# EAGLE design Zavlazovac-v20 (EAGLE 4.11)
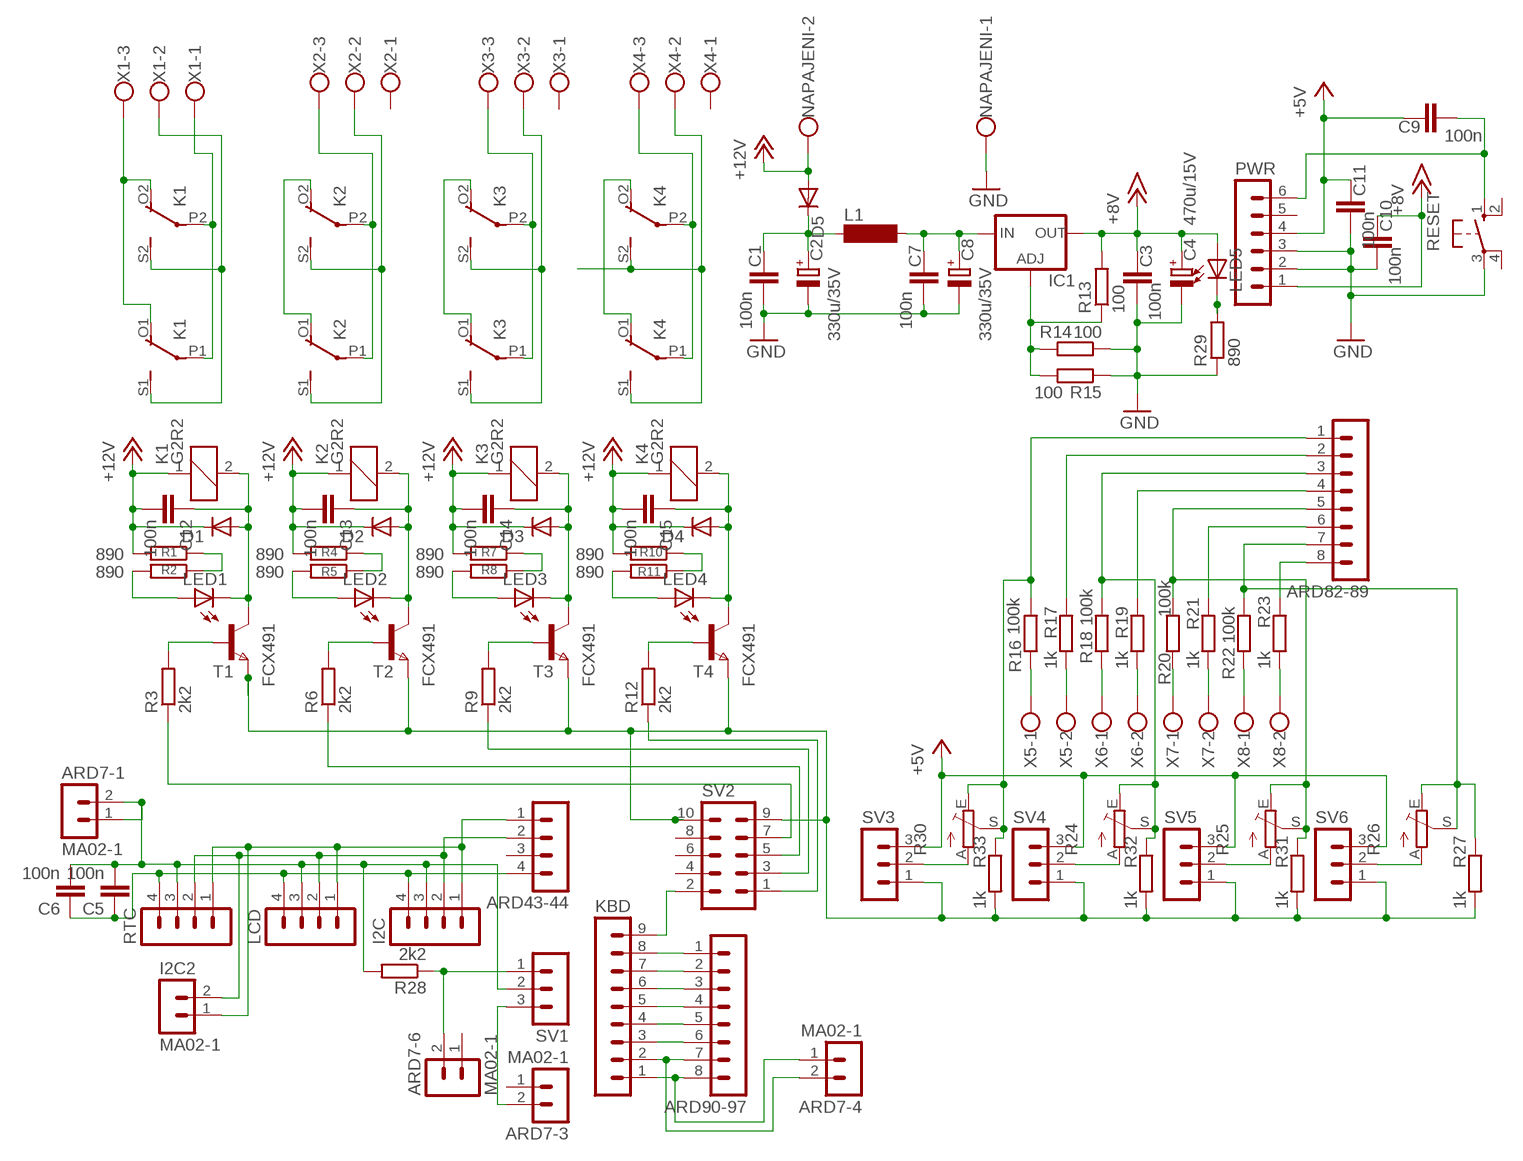
[diagram p0: schematic, sheet 1]

## Parts
ARD7-1  MA02-1  [MA02-01]
ARD7-3  MA02-1  [MA02-01]
ARD7-4  MA02-1  [MA02-01]
ARD7-6  MA02-1  [MA02-01]
ARD43-44  MA04-1  [MA04-1]
ARD82-89  MA08-1  [MA08-1]
ARD90-97  MA08-1  [MA08-1]
C1  100n  C-EUC1206  [C1206]
C2  330u/35V  CPOL-EUE5-8.5  [E5-8,5]
C3  100n  C-EUC1206  [C1206]
C4  470u/15V  CPOL-EUE5-8.5  [E5-8,5]
C5  100n  C-EUC1206  [C1206]
C6  100n  C-EUC1206  [C1206]
C7  100n  C-EUC1206  [C1206]
C8  330u/35V  CPOL-EUE5-8.5  [E5-8,5]
C9  100n  C-EUC1206  [C1206]
C10  100n  C-EUC1206  [C1206]
C11  100n  C-EUC1206  [C1206]
C12  100n  C-EUC1206  [C1206]
C13  100n  C-EUC1206  [C1206]
C14  100n  C-EUC1206  [C1206]
C15  100n  C-EUC1206  [C1206]
D1  DIODE-SMB  [SMB]
D2  DIODE-SMB  [SMB]
D3  DIODE-SMB  [SMB]
D4  DIODE-SMB  [SMB]
D5  DIODE-SMB  [SMB]
I2C  MA04-1  [MA04-1]
I2C2  MA02-1  [MA02-01]
IC1  LM317TL  [317TL]
K1  G2R2  [G2R2]
K2  G2R2  [G2R2]
K3  G2R2  [G2R2]
K4  G2R2  [G2R2]
KBD  MA09-1  [MA09-1]
L1  MS85  [MS85]
LCD  MA04-1  [MA04-1]
LED1  LED5MM  [LED5MM]
LED2  LED5MM  [LED5MM]
LED3  LED5MM  [LED5MM]
LED4  LED5MM  [LED5MM]
LED5  LED5MM  [LED5MM]
NAPAJENI  W237-102  [W237-102]
PWR  MA06-1  [MA06-1]
R1  890  R-EU_M1206  [M1206]
R2  890  R-EU_M1206  [M1206]
R3  2k2  R-EU_M1206  [M1206]
R4  890  R-EU_M1206  [M1206]
R5  890  R-EU_M1206  [M1206]
R6  2k2  R-EU_M1206  [M1206]
R7  890  R-EU_M1206  [M1206]
R8  890  R-EU_M1206  [M1206]
R9  2k2  R-EU_M1206  [M1206]
R10  890  R-EU_M1206  [M1206]
R11  890  R-EU_M1206  [M1206]
R12  2k2  R-EU_M1206  [M1206]
R13  100  R-EU_M1206  [M1206]
R14  100  R-EU_M1206  [M1206]
R15  100  R-EU_M1206  [M1206]
R16  100k  R-EU_M1206  [M1206]
R17  1k  R-EU_M1206  [M1206]
R18  100k  R-EU_M1206  [M1206]
R19  1k  R-EU_M1206  [M1206]
R20  100k  R-EU_M1206  [M1206]
R21  1k  R-EU_M1206  [M1206]
R22  100k  R-EU_M1206  [M1206]
R23  1k  R-EU_M1206  [M1206]
R24  TRIM_EU-S75H  [S75H]
R25  TRIM_EU-S75H  [S75H]
R26  TRIM_EU-S75H  [S75H]
R27  1k  R-EU_M1206  [M1206]
R28  2k2  R-EU_M1206  [M1206]
R29  890  R-EU_M1206  [M1206]
R30  TRIM_EU-S75H  [S75H]
R31  1k  R-EU_M1206  [M1206]
R32  1k  R-EU_M1206  [M1206]
R33  1k  R-EU_M1206  [M1206]
RESET  10-XX  [B3F-10XX]
RTC  MA04-1  [MA04-1]
SV1  MA03-1  [MA03-1]
SV2  MA05-2  [MA05-2]
SV3  MA03-1  [MA03-1]
SV4  MA03-1  [MA03-1]
SV5  MA03-1  [MA03-1]
SV6  MA03-1  [MA03-1]
T1  FCX491  NPNSOT89  [SOT89]
T2  FCX491  NPNSOT89  [SOT89]
T3  FCX491  NPNSOT89  [SOT89]
T4  FCX491  NPNSOT89  [SOT89]
X1  W237-103  [W237-103]
X2  W237-103  [W237-103]
X3  W237-103  [W237-103]
X4  W237-103  [W237-103]
X5  W237-102  [W237-102]
X6  W237-102  [W237-102]
X7  W237-102  [W237-102]
X8  W237-102  [W237-102]

## Nets
+5V: C9.1 C11.1 PWR.4 SV3.3 SV4.3 SV5.3 SV6.3
+8V: C3.1 C4.+ C10.1 IC1.2(OUT) LED5.A PWR.1 R13.2
+12V: C12.2 C13.2 C14.2 C15.2 D1.C D2.C D3.C D4.C D5.A K1.1 K2.1 K3.1 K4.1 NAPAJENI.2 R1.2 R4.2 R7.2 R10.2
GND: C1.2 C2.- C3.2 C4.- C7.2 C8.- C10.2 C11.2 NAPAJENI.1 PWR.2 PWR.3 R14.1 R15.1 R29.1 RESET.3(P)
N$1: R1.1 R2.1
N$2: LED1.A R2.2
N$3: C12.1 D1.A K1.2 LED1.K(C) T1.2(C)
N$4: R3.2 T1.1(B)
N$5: R12.1 SV2.1
N$6: K4.P1(2:P) K4.P2(3:P) X4.3
N$7: K1.S1(2:S) K1.S2(3:S) X1.2
N$8: C13.1 D2.A K2.2 LED2.K(C) T2.2(C)
N$9: R6.2 T2.1(B)
N$10: C9.2 PWR.6 RESET.1(S)
N$11: LED5.K(C) R29.2
N$12: K2.S1(2:S) K2.S2(3:S) X2.2
N$13: R4.1 R5.1
N$14: LED2.A R5.2
N$15: C14.1 D3.A K3.2 LED3.K(C) T3.2(C)
N$16: R9.2 T3.1(B)
N$18: ARD7-1.1 ARD7-1.2 C5.2 C6.2 I2C.3 LCD.3 R28.2 RTC.3 SV1.2
N$19: K3.S1(2:S) K3.S2(3:S) X3.2
N$20: R7.1 R8.1
N$21: LED3.A R8.2
N$22: C15.1 D4.A K4.2 LED4.K(C) T4.2(C)
N$23: R12.2 T4.1(B)
N$24: K1.P1(2:P) K1.P2(3:P) X1.1
N$25: R30.A SV3.2
N$26: IC1.1(ADJ) R13.1 R14.2 R15.2
N$27: R27.2 R31.2 R32.2 R33.2 SV2.9 SV2.10 SV3.1 SV4.1 SV5.1 SV6.1 T1.3(E) T2.3(E) T3.3(E) T4.3(E)
N$28: K4.S1(2:S) K4.S2(3:S) X4.2
N$29: R10.1 R11.1
N$30: LED4.A R11.2
N$31: R24.A SV4.2
N$32: R25.A SV5.2
N$33: R26.A SV6.2
N$34: ARD82-89.1 R16.1 R30.E R30.S R33.1
N$35: ARD82-89.2 R17.1
N$36: ARD82-89.3 R18.1 R24.E R24.S R32.1
N$37: ARD82-89.4 R19.1
N$38: ARD82-89.5 R20.1 R25.E R25.S R31.1
N$39: ARD82-89.6 R21.1
N$40: ARD43-44.4 C5.1 C6.1 I2C.4 LCD.4 RTC.4
N$41: ARD82-89.8 R23.1
N$42: R16.2 X5.1
N$43: R17.2 X5.2
N$44: R18.2 X6.1
N$45: R19.2 X6.2
N$46: R20.2 X7.1
N$47: R21.2 X7.2
N$48: R22.2 X8.1
N$49: R23.2 X8.2
N$50: ARD7-4.1 ARD90-97.8 KBD.1
N$51: K2.P1(2:P) K2.P2(3:P) X2.3
N$52: K3.P1(2:P) K3.P2(3:P) X3.3
N$53: ARD7-6.2 R28.1 SV1.1
N$54: ARD82-89.7 R22.1 R26.E R26.S R27.1
N$55: ARD7-4.2 ARD90-97.7 KBD.2
N$56: ARD90-97.6 KBD.3
N$57: ARD90-97.5 KBD.4
N$58: ARD90-97.4 KBD.5
N$59: ARD90-97.3 KBD.6
N$60: ARD90-97.2 KBD.7
N$61: ARD90-97.1 KBD.8
N$62: K1.O1(2:O) K1.O2(3:O) X1.3
N$63: R9.1 SV2.3
N$64: R6.1 SV2.5
N$65: R3.1 SV2.7
N$66: KBD.9 SV2.2
N$67: C1.1 C2.+ D5.C L1.1
N$68: C7.1 C8.+ IC1.3(IN) L1.2
N$69: K2.O1(2:O) K2.O2(3:O)
N$70: K3.O1(2:O) K3.O2(3:O)
N$71: K4.O1(2:O) K4.O2(3:O)
N$72: ARD7-3.2 SV1.3
SCL: ARD43-44.1 I2C2.1 I2C.1 LCD.1 RTC.1
SDA: ARD43-44.2 I2C2.2 I2C.2 LCD.2 RTC.2
Unconnected: ARD7-3.1 ARD7-6.1 ARD43-44.3 PWR.5 RESET.2(S1) RESET.4(P1) SV2.4 SV2.6 SV2.8 X2.1 X3.1 X4.1

## Library data of the parts
ARD7-1 ARD7-3 ARD7-4 ARD7-6 I2C2 = con-lstb:MA02-1
ARD43-44 I2C LCD RTC = con-lstb:MA04-1: PIN HEADER
ARD82-89 ARD90-97 = con-lstb:MA08-1: PIN HEADER
C1 C3 C5-C7 C9-C15 = rcl:C-EU: CAPACITOR, European symbol
C2 C4 C8 = rcl:CPOL-EU: POLARIZED CAPACITOR, European symbol
D1-D5 = diode:DIODE-: DIODE
IC1 = v-reg:LM317TL: VOLTAGE REGULATOR
K1-K4 = relay:G2R2: RELAY 2 x switch, Omron
KBD = con-lstb:MA09-1: PIN HEADER
L1 = inductor-neosid:MS85: INDUCTOR SMD power inductor
LED1-LED5 = led:LED: LED OSRAM: - CHIPLED LG R971, LG N971, LY N971, LG Q971, LY Q971, LO R971, LY R971 LH N974, LH R974 LS Q976, LO Q976, LY Q976 LO Q996 - Hyper CHIPLED LW Q18S LB Q993, LB Q99A, LB R99A - SideLED LS A670, LO A670, LY A670, LG A670, LP A670 LB A673, LV A673, LT A673, LW A673 LH A674 LY A675 LS A676, LA A676, LO A676, LY A676, LW A676 LS A679, LY A679, LG A679 - Hyper Micro SIDELED® LS Y876, LA Y876, LO Y876, LY Y876 LT Y87S - SmartLED LW L88C, LW L88S LB L89C, LB L89S, LG L890 LS L89K, LO L89K, LY L89K LS L896, LA L896, LO L896, LY L896 - TOPLED LS T670, LO T670, LY T670, LG T670, LP T670 LSG T670, LSP T670, LSY T670, LOP T670, LYG T670 LG T671, LOG T671, LSG T671 LB T673, LV T673, LT T673, LW T673 LH T674 LS T676, LA T676, LO T676, LY T676, LB T676, LH T676, LSB T676, LW T676 LB T67C, LV T67C, LT T67C, LS T67K, LO T67K, LY T67K, LW E67C LS E67B, LA E67B, LO E67B, LY E67B, LB E67C, LV E67C, LT E67C LW T67C LS T679, LY T679, LG T679 LS T770, LO T770, LY T770, LG T770, LP T770 LB T773, LV T773, LT T773, LW T773 LH T774 LS E675, LA E675, LY E675, LS T675 LS T776, LA T776, LO T776, LY T776, LB T776 LHGB T686 LT T68C, LB T68C - Hyper Mini TOPLED® LB M676 - Mini TOPLED Santana® LG M470 LS M47K, LO M47K, LY M47K Source: http://www.osram.convergy.de/
NAPAJENI X5-X8 = con-wago-500:W237-102: WAGO SCREW CLAMP
PWR = con-lstb:MA06-1: PIN HEADER
R1-R23 R27-R29 R31-R33 = rcl:R-EU_: RESISTOR, European symbol
R24-R26 R30 = pot:TRIM_EU-: POTENTIOMETER
RESET = switch-omron:10-XX: OMRON SWITCH
SV1 SV3-SV6 = con-lstb:MA03-1: PIN HEADER
SV2 = con-lstb:MA05-2: PIN HEADER
T1-T4 = zetex:NPNSOT89: NPN TRANSISTOR
X1-X4 = con-wago-500:W237-103: WAGO SCREW CLAMP

## Board
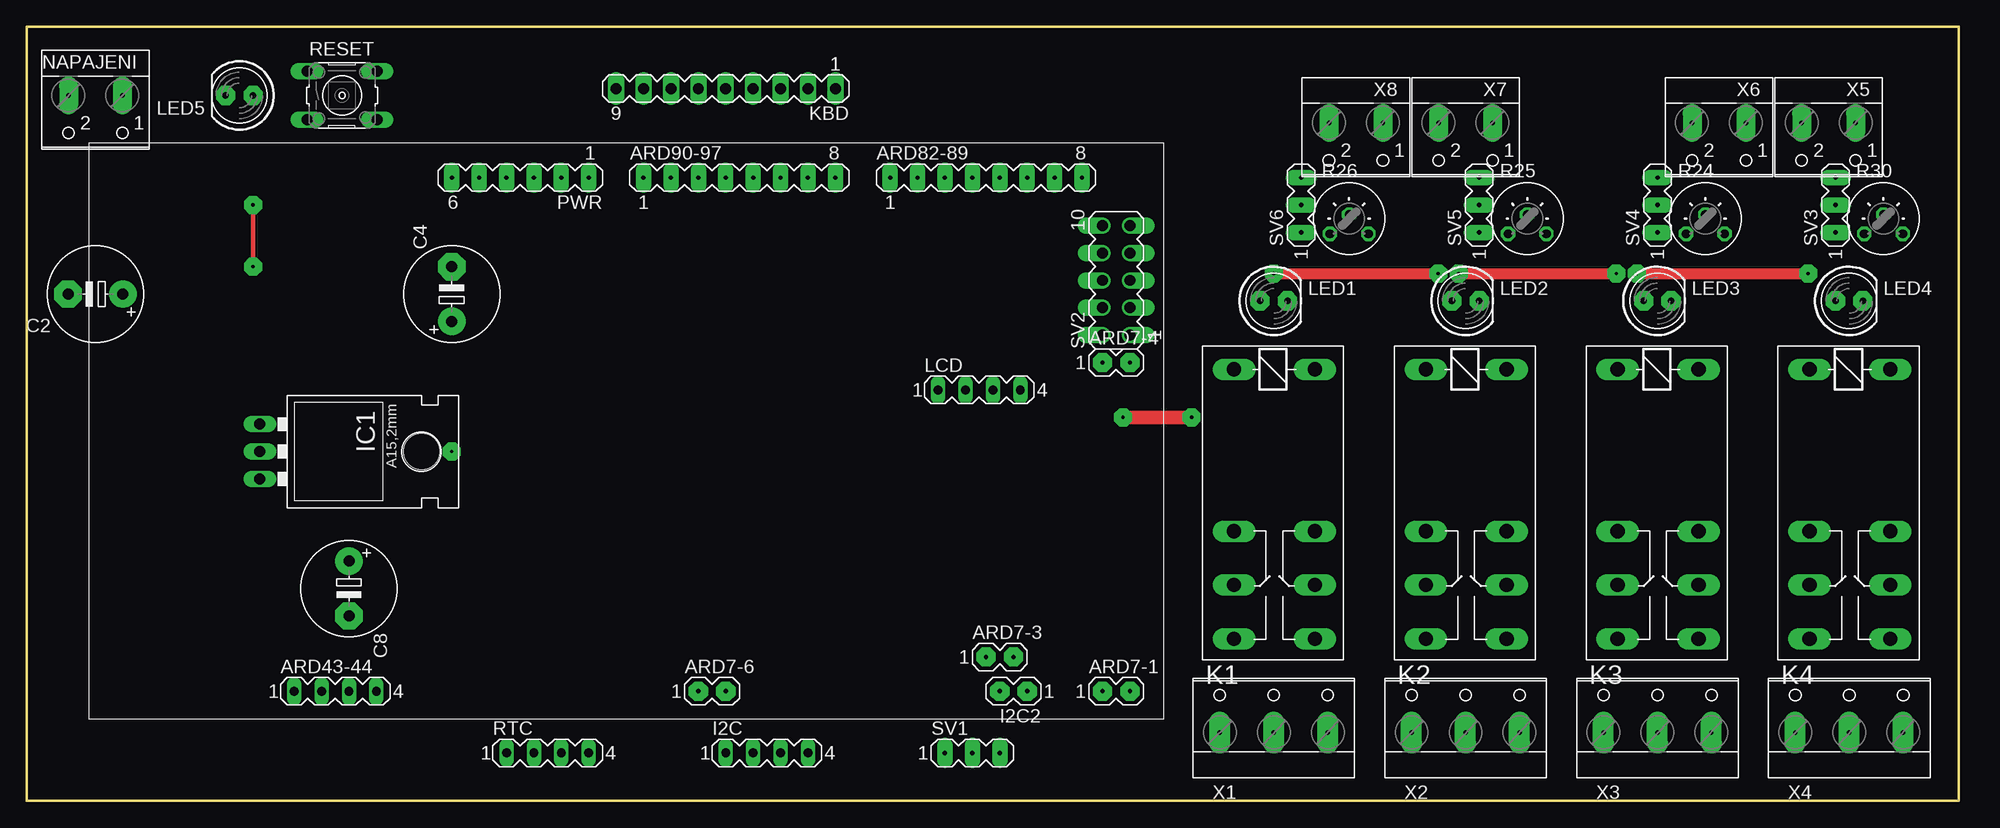
[diagram p1: board, top side]
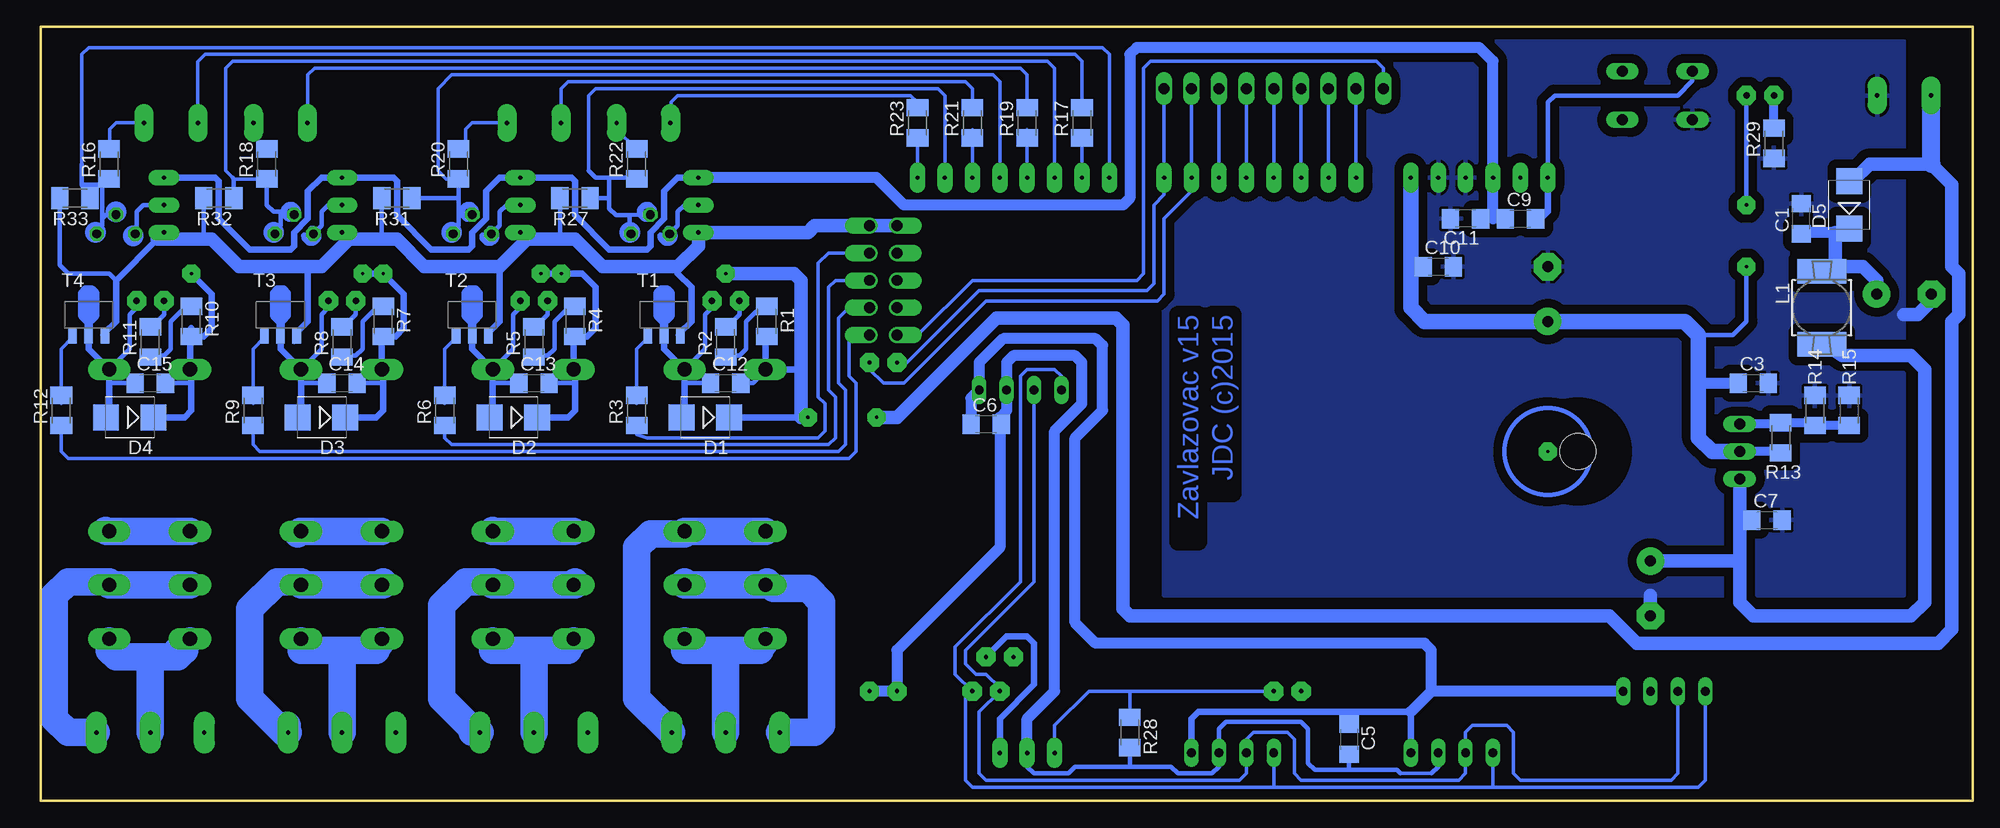
[diagram p2: board, bottom side, seen from below]

Size 179.07 x 71.75 mm. Coordinates in mm from the lower left corner, seen from the top.
Outline: 0,0 179.07,0 179.07,71.75 0,71.75 0,0
Copper layers (1*16): Top 0.035mm / dielectric 1.5mm / Bottom 0.035mm
Design rules "default": minimum track width 10mil, minimum drill 24mil, track to track 8mil, track to pad 8mil, pad to pad 8mil, via to via 8mil, smd to smd 8mil, copper to edge 40mil, drill to drill 8mil, minimum pad ring 10mil, minimum via ring 8mil, stop-mask expansion 4mil, vias tented up to drill 0mil, thermal gap 10mil

### Footprints (pad centres in the part's own frame; a part is rotated, then mirrored left to right if it is on the bottom)
MA02-01 = drill 0.406 pad 1.778 octagon: 1 0,0; 2 2.54,0
MA04-1 = drill 0.813 pad 1.27 long: 1 -3.81,0; 2 -1.27,0; 3 1.27,0; 4 3.81,0
MA08-1 = drill 0.406 pad 1.422 long: 1 -8.89,0; 2 -6.35,0; 3 -3.81,0; 4 -1.27,0; 5 1.27,0; 6 3.81,0; 7 6.35,0; 8 8.89,0
C1206 = smd 1.6 x 1.8: 1 -1.4,0; 2 1.4,0
E5-8,5 = drill 1.016 pad 2.54 round: + -2.54,0 | drill 1.016 pad 2.54 octagon: - 2.54,0
SMB = smd 2.4 x 2.4: A 2.2,0; C -2.2,0
317TL = drill 1.016 long: 1 -2.54,-3.81; 2 0,-3.81; 3 2.54,-3.81 | hole 3.302: 0,11.176
G2R2 = drill 1.321 long: 1 -2.54,-3.683; 2 -2.54,3.81; O1 12.471,3.81; O2 12.471,-3.683; P1 17.45,3.81; P2 17.45,-3.683; S1 22.454,3.81; S2 22.454,-3.683
MA09-1 = drill 1.016 long: 1 -10.16,0; 2 -7.62,0; 3 -5.08,0; 4 -2.54,0; 5 0,0; 6 2.54,0; 7 5.08,0; 8 7.62,0; 9 10.16,0
MS85 = smd 4.5 x 2.25: 1 0,-3.383; 2 0,3.383
LED5MM = drill 0.61 pad 1.778 octagon: A -1.27,0; K 1.27,0
W237-102 = drill 0.406 pad 1.778 long: 1 -2.5,-1.27; 2 2.5,-1.27
MA06-1 = drill 0.406 pad 1.422 long: 1 -6.35,0; 2 -3.81,0; 3 -1.27,0; 4 1.27,0; 5 3.81,0; 6 6.35,0
M1206 = smd 1.6 x 2: 1 -1.4,0; 2 1.4,0
S75H = drill 0.813 octagon: A -1.778,-1.397; E 1.778,-1.397; S 0,0.381
B3F-10XX = drill 1.016 long: 1 -3.251,2.261; 2 3.251,2.261; 3 -3.251,-2.261; 4 3.251,-2.261
MA03-1 = drill 0.406 pad 1.422 long: 1 -2.54,0; 2 0,0; 3 2.54,0
MA05-2 = drill 1.016 offset: 1 -5.08,-1.27; 2 -5.08,1.27; 3 -2.54,-1.27; 4 -2.54,1.27; 5 0,-1.27; 6 0,1.27; 7 2.54,-1.27; 8 2.54,1.27; 9 5.08,-1.27; 10 5.08,1.27
SOT89 = smd 0.8 x 1.4: 1 -1.499,-1.981; 2 0,-1.981; 3 1.499,-1.981
W237-103 = drill 0.406 pad 1.93 long: 1 -5,-1.29; 2 0,-1.29; 3 5,-1.29

### Placement (x,y rotation side)
ARD7-1  99.69,10.16 0 top
ARD7-3  88.9,13.34 0 top
ARD7-4  99.69,40.64 0 top
ARD7-6  62.23,10.16 0 top
ARD43-44  28.57,10.16 0 top
ARD82-89  88.9,57.78 0 top
ARD90-97  66.04,57.78 0 top
C1  15.88,53.98 90 bottom
C2  6.35,46.99 180 top
C3  20.32,38.73 0 bottom
C4  39.37,46.99 90 top
C5  57.78,5.71 270 bottom
C6  91.44,34.92 0 bottom
C7  19.05,26.04 0 bottom
C8  29.84,19.68 270 top
C9  41.91,53.98 0 bottom
C10  49.53,49.53 0 bottom
C11  46.99,53.98 180 bottom
C12  115.57,38.73 0 bottom
C13  133.35,38.73 0 bottom
C14  151.13,38.73 0 bottom
C15  168.91,38.73 0 bottom
D1  117.47,35.56 180 bottom
D2  135.25,35.56 180 bottom
D3  153.03,35.56 180 bottom
D4  170.81,35.56 180 bottom
D5  11.43,55.24 90 bottom
I2C  68.58,4.45 0 top
I2C2  92.71,10.16 180 top
IC1  25.4,32.38 270 top
K1  115.57,37.47 270 top
K2  133.35,37.47 270 top
K3  151.13,37.47 270 top
K4  168.91,37.47 270 top
KBD  64.77,66.04 180 top
L1  13.97,45.72 180 bottom
LCD  88.27,38.1 0 top
LED1  115.57,46.35 0 top
LED2  133.35,46.35 0 top
LED3  151.13,46.35 0 top
LED4  168.91,46.35 0 top
LED5  19.68,65.41 180 top
NAPAJENI  6.35,64.14 180 top
PWR  45.72,57.78 180 top
R1  111.76,44.45 270 bottom
R2  115.57,42.55 90 bottom
R3  123.83,36.2 90 bottom
R4  129.54,44.45 270 bottom
R5  133.35,42.55 90 bottom
R6  141.6,36.2 90 bottom
R7  147.32,44.45 270 bottom
R8  151.13,42.55 90 bottom
R9  159.38,36.2 90 bottom
R10  165.1,44.45 270 bottom
R11  168.91,42.55 90 bottom
R12  177.16,36.2 90 bottom
R13  17.78,33.66 270 bottom
R14  14.61,36.2 270 bottom
R15  11.43,36.2 270 bottom
R16  172.72,59.05 90 bottom
R17  82.55,62.87 90 bottom
R18  158.12,59.05 90 bottom
R19  87.63,62.87 90 bottom
R20  140.34,59.05 90 bottom
R21  92.71,62.87 90 bottom
R22  123.83,59.05 90 bottom
R23  97.79,62.87 90 bottom
R24  155.57,53.98 0 top
R25  139.06,53.98 0 top
R26  122.56,53.98 0 top
R27  129.54,55.88 180 bottom
R28  78.11,6.35 270 bottom
R29  18.41,60.96 90 bottom
R30  172.09,53.98 0 top
R31  146.05,55.88 180 bottom
R32  162.56,55.88 180 bottom
R33  175.9,55.88 180 bottom
RESET  29.21,65.41 0 top
RTC  48.26,4.45 0 top
SV1  87.63,4.45 0 top
SV2  100.97,48.26 90 top
SV3  167.64,55.24 90 top
SV4  151.13,55.24 90 top
SV5  134.62,55.24 90 top
SV6  118.11,55.24 90 top
T1  121.28,45.09 0 bottom
T2  139.06,45.09 0 bottom
T3  156.84,45.09 0 bottom
T4  174.62,45.09 0 bottom
X1  115.57,7.62 0 top
X2  133.35,7.62 0 top
X3  151.13,7.62 0 top
X4  168.91,7.62 0 top
X5  167,61.59 180 top
X6  156.84,61.59 180 top
X7  133.35,61.59 180 top
X8  123.19,61.59 180 top

### Tracks (layer width: path | path; a pad name or v marks a point on that pad's centre or on a via)
+5V
  Bottom 0.61: SV3.3 162.88,57.78 162.56,57.47 162.56,53.98 159.7,51.12 155.89,51.12 155.57,51.44 155.57,52.7 154.31,53.98 154.31,56.52 153.03,57.78 SV4.3 146.37,57.78 146.05,57.47 146.05,54.29 142.88,51.12 139.38,51.12 139.06,51.44 139.06,52.7 137.79,53.98 137.79,56.52 136.53,57.78 SV5.3 129.86,57.78 129.54,57.47 129.54,54.29 126.36,51.12 122.87,51.12 122.56,51.44 122.56,52.7 121.28,53.98 121.28,56.52 120.02,57.78 SV6.3 | 44.45,53.98 C11.1 C9.1 43.18,53.98
  Bottom 1.016: SV6.3 101.6,57.78 99.06,55.24 78.74,55.24 78.11,55.88 78.11,69.22 77.47,69.85 45.72,69.85 44.45,68.58 PWR.4 44.45,53.98
+8V  (via drill 0.3 pad 1.68)
  Top 0.406: v20.95,49.53 v20.95,55.24
  Bottom 0.406: v20.95,55.24 LED5.A | v20.95,49.53 20.95,44.45 22.23,43.18 25.4,43.18
  Bottom 0.813: R13.2 17.78,32.38 IC1.2
  Bottom 1.016: 25.4,38.73 C3.1 | 52.07,49.53 C10.1
  Bottom 1.422: IC1.2 24.13,32.38 25.4,33.66 25.4,38.73 25.4,43.18 26.67,44.45 C4.+ 50.8,44.45 52.07,45.72 52.07,49.53 PWR.1
+12V  (via drill 0.3 pad 1.68)
  Top 1.016: v149.22,48.9 v165.1,48.9 | v132.72,48.9 v147.32,48.9 | v115.57,48.9 v130.81,48.9
  Top 1.27: v101.6,35.56 v107.95,35.56
  Bottom 0.406: 111.76,43.18 111.76,42.55 | C12.2 113.03,38.73 111.76,40.01 | 129.54,38.73 C13.2 | 147.32,38.73 C14.2 | 165.1,38.73 C15.2
  Bottom 0.61: v165.1,48.9 163.19,46.99 163.19,43.81 163.96,43.05 R10.2 165.1,43.81 165.23,43.69 K4.1 165.1,40.01 165.1,38.73 165.1,36.2 165.74,35.56 D4.C | v149.22,48.9 v147.32,48.9 145.41,46.99 145.41,43.81 146.18,43.05 R7.2 147.32,43.18 147.45,43.05 K3.1 147.32,40.01 147.32,38.73 147.32,36.2 147.96,35.56 D3.C | v132.72,48.9 v130.81,48.9 128.91,48.9 127.64,47.62 127.64,43.81 128.4,43.05 R4.2 129.54,42.55 129.67,42.42 K2.1 129.54,40.01 129.54,38.73 129.54,36.2 130.18,35.56 D2.C | 111.76,42.55 111.89,42.42 | v107.95,35.56 D1.C | R1.2 111.76,43.18 111.89,43.05 K1.1 111.76,40.01 108.58,40.01
  Bottom 1.27: v115.57,48.9 109.22,48.9 108.58,48.26 108.58,40.01 108.58,35.56 v107.95,35.56 | v101.6,35.56 99.69,35.56 90.49,44.77 79.38,44.77 78.74,44.13 78.74,17.78 78.11,17.14 33.66,17.14 31.11,14.61 3.17,14.61 1.91,15.88 1.91,44.45 1.27,45.09 1.27,48.9 1.91,49.53 1.91,57.15 3.81,59.05 9.53,59.05 11.13,57.45 D5.A | 3.81,65.41 NAPAJENI.2
  Bottom 1.676: 3.81,59.05 3.81,65.41
GND
  Bottom 1.27: C8.- 29.84,19.05 | C2.- 3.81,46.35 5.08,45.09 6.35,45.09
  pour Bottom (isolate 0.813): 6.35,19.05 74.93,19.05 74.93,70.48 6.35,70.48
N$1
  Bottom 0.406: R1.1 111.76,46.35 113.67,44.45 113.67,41.91 114.3,41.27 115.57,41.27 R2.1
N$2
  Bottom 0.406: R2.2 115.44,43.95 114.3,45.09 LED1.A
N$3
  Bottom 0.406: LED1.K 116.84,45.72 117.47,45.09 117.47,41.91 K1.2 | C12.1 119.38,38.73
  Bottom 0.61: T1.2 121.28,41.91 K1.2 119.38,38.73 119.38,35.56 D1.A
N$4
  Bottom 0.305: T1.1 122.78,42.95 123.83,41.91 R3.2 123.83,36.83
N$5
  Bottom 0.305: R12.1 177.16,32.38 176.53,31.75 104.14,31.75 103.5,32.38 103.5,38.73 104.14,39.37 104.14,42.55 103.5,43.18 SV2.1
N$6
  Bottom 2.54: K4.P2 K4.P1 172.72,20.32 176.53,20.32 177.8,19.05 177.8,7.62 176.53,6.35 175.9,6.35 175.88,6.33 X4.3
N$7
  Bottom 2.184: 119.38,13.97 K1.S1 | K1.S2 111.89,14.48 112.39,13.97
  Bottom 2.54: 115.57,13.97 112.39,13.97 | 115.57,13.97 119.38,13.97 | X1.2 115.57,13.97
N$8
  Bottom 0.406: LED2.K 134.62,45.72 135.25,45.09 135.25,41.91 K2.2 | C13.1 137.16,38.73
  Bottom 0.61: T2.2 139.06,41.91 K2.2 137.16,38.73 137.16,35.56 D2.A
N$9
  Bottom 0.305: T2.1 140.56,42.95 141.6,41.91 R6.2 141.6,36.83
N$10
  Bottom 0.406: RESET.1 25.96,66.75 27.3,65.41 38.73,65.41 39.37,64.77 PWR.6
  Bottom 0.61: C9.2 40.01,53.98 39.37,54.61 PWR.6
N$11
  Bottom 0.813: R29.2 LED5.K
N$12
  Bottom 2.184: 137.16,13.97 K2.S1 | K2.S2 129.67,14.48 130.18,13.97
  Bottom 2.54: 133.35,13.97 130.18,13.97 | 133.35,13.97 137.16,13.97 | X2.2 133.35,13.97
N$13
  Bottom 0.406: R4.1 129.54,46.35 131.44,44.45 131.44,41.91 132.08,41.27 133.35,41.27 R5.1
N$14
  Bottom 0.406: R5.2 133.22,43.95 132.08,45.09 LED2.A
N$15
  Bottom 0.406: LED3.K 152.4,45.72 153.03,45.09 153.03,41.91 K3.2 | C14.1 154.94,38.73
  Bottom 0.61: T3.2 156.84,41.91 K3.2 154.94,38.73 154.94,35.56 D3.A
N$16
  Bottom 0.305: T3.1 158.34,42.95 159.38,41.91 R9.2 159.38,36.83
N$17  (via drill 0.3 pad 1.68)
  other vias: 39.37,32.38
N$18
  Bottom 0.305: 50.16,2.54 53.02,2.54
  Bottom 0.406: RTC.3 49.53,3.17 50.16,2.54 | 53.02,2.54 53.34,2.86 57.78,2.86 | 57.78,2.86 60.96,2.86 61.59,3.49 61.59,6.67 62.23,7.3 69.22,7.3 69.85,6.67 I2C.3 69.85,3.17 70.48,2.54 73.66,2.54 74.3,3.17 78.11,3.17 | 57.78,2.86 C5.2 | 78.11,3.17 83.19,3.17 83.82,2.54 87,2.54 87.63,3.17 SV1.2 | 78.11,3.17 R28.2
  Bottom 1.016: ARD7-1.2 ARD7-1.1 99.69,13.97 90.17,23.5 90.17,34.92 | SV1.2 87.63,7.62 85.09,10.16 85.09,34.29 82.55,36.83 82.55,40.64 83.19,41.27 88.9,41.27 89.53,40.64 LCD.3 89.53,36.2 90.17,35.56 90.17,34.92 | 90.17,34.92 C6.2
N$19
  Bottom 2.184: 154.94,13.97 K3.S1 | K3.S2 147.45,14.48 147.96,13.97
  Bottom 2.54: 151.13,13.97 147.96,13.97 | 151.13,13.97 154.94,13.97 | X3.2 151.13,13.97
N$20
  Bottom 0.406: R7.1 147.32,46.35 149.22,44.45 149.22,41.91 149.86,41.27 151.13,41.27 R8.1
N$21
  Bottom 0.406: R8.2 151,43.95 149.86,45.09 LED3.A
N$22
  Bottom 0.406: LED4.K 170.18,45.72 170.81,45.09 170.81,41.91 K4.2 | C15.1 172.72,38.73
  Bottom 0.61: T4.2 174.62,41.91 K4.2 172.72,38.73 172.72,35.56 D4.A
N$23
  Bottom 0.305: T4.1 176.12,42.95 177.16,41.91 R12.2 177.16,36.83
N$24
  Bottom 2.54: 119.38,20.32 K1.P1 K1.P2 111.89,20.19 111.76,20.32 111.12,19.68 107.95,19.68 106.68,18.41 106.68,6.99 107.33,6.33 X1.1
N$25
  Bottom 0.406: SV3.2 169.54,55.24 170.18,54.61 170.18,52.7 R30.A
N$26
  Bottom 0.813: IC1.1 17.78,34.92 R13.1 14.73,35.05 14.61,34.92 R14.2 11.56,34.8 11.43,34.92 R15.2
N$27
  Bottom 0.406: T4.3 173.28,43.1 173.35,43.18 173.13,43.41 | 155.35,43.41 T3.3 | T3.3 155.35,42.77 155.57,42.55 155.57,43.18 155.5,43.1 T3.3 | T2.3 137.72,43.1 137.79,43.18 137.57,43.41 | T1.3 119.94,43.1 120.02,43.18 119.79,43.41 | R27.2 130.94,52.2 130.81,52.07 | R31.2 147.45,52.2 147.32,52.07 | R32.2 163.96,52.2 163.83,52.07 | R33.2 177.29,49.66 176.53,48.9 172.72,48.9 172.09,48.26
  Bottom 0.61: 167,52.07 SV3.1 | 150.5,52.07 SV4.1 | 133.99,52.07 SV5.1 | 173.13,43.41 172.09,44.45 172.09,48.26 168.28,52.07 | 155.35,43.41 154.31,44.45 154.31,49.53 | 137.57,43.41 136.53,44.45 136.53,49.53 | 119.79,43.41 118.75,44.45 118.75,47.62 120.02,48.9 120.02,49.53
  Bottom 1.27: 168.28,52.07 167,52.07 163.83,52.07 163.19,52.07 160.66,49.53 154.31,49.53 153.03,49.53 150.5,52.07 147.32,52.07 146.05,52.07 143.51,49.53 136.53,49.53 133.99,52.07 130.81,52.07 129.54,52.07 127,49.53 120.02,49.53 118.11,51.44 SV6.1 107.95,52.7 107.31,53.34 SV2.9 SV2.10
N$28
  Bottom 2.184: 172.72,13.97 K4.S1 | K4.S2 165.23,14.73 165.74,13.97
  Bottom 2.54: 166.05,13.65 165.74,13.97 | 166.05,13.65 166.37,13.34 168.91,13.34 | 168.91,13.34 172.09,13.34 172.72,13.97 | 166.05,13.65 166.37,13.97 166.41,13.93 | X4.2 168.91,13.34
N$29
  Bottom 0.406: R10.1 165.1,46.35 167,44.45 167,41.91 167.64,41.27 168.91,41.27 R11.1
N$30
  Bottom 0.406: LED4.A 167.64,45.09 168.91,43.81 R11.2
N$31
  Bottom 0.406: SV4.2 152.4,55.24 153.03,54.61 153.03,53.34 R24.A
N$32
  Bottom 0.406: SV5.2 135.89,55.24 136.53,54.61 136.53,53.34 R25.A
N$33
  Bottom 0.406: SV6.2 119.38,55.24 120.02,54.61 120.02,53.34 R26.A
N$34
  Bottom 0.305: ARD82-89.1 80.01,69.22 80.64,69.85 174.62,69.85 175.26,69.22 175.26,59.05
  Bottom 0.406: R30.E 173.99,52.7 173.35,53.34 173.35,53.98 | 173.35,57.15 173.35,53.98 | 173.35,57.15 172.85,57.66 R16.1 | R30.S 172.97,54.36 173.35,53.98 | R33.1 174.62,55.88 175.26,57.15 | 175.26,59.05 175.26,57.15 | 175.26,57.15 173.35,57.15
N$35
  Bottom 0.305: ARD82-89.2 R17.1
N$36
  Bottom 0.305: ARD82-89.3 85.09,67.94 85.72,68.58 161.29,68.58 161.93,67.94 161.93,58.42 161.29,57.78 | 161.16,57.66 R18.1
  Bottom 0.406: R24.E 157.48,52.7 156.84,53.34 156.84,54.61 | R18.1 158.12,55.24 157.48,54.61 156.84,54.61 | R24.S 156.59,54.36 156.84,54.61 | R32.1 161.16,57.66 161.29,57.78
N$37
  Bottom 0.305: 87.63,62.23 R19.1 ARD82-89.4
N$38
  Bottom 0.305: ARD82-89.5 90.17,66.67 90.81,67.31 140.97,67.31 142.24,66.04 142.24,58.42 141.47,57.66 R20.1
  Bottom 0.406: R25.E 140.97,52.7 140.34,53.34 140.34,54.61 | R20.1 140.34,55.88 | 140.34,55.88 140.34,54.61 | R25.S 140.08,54.36 140.34,54.61 | 140.34,55.88 R31.1
N$39
  Bottom 0.305: 92.71,62.23 R21.1 ARD82-89.6
N$40
  Bottom 0.406: 57.78,8.26 C5.1
  Bottom 0.61: RTC.4 52.07,8.26 57.78,8.26 71.75,8.26 72.39,7.62 I2C.4
  Bottom 1.016: ARD43-44.4 50.16,10.16 | 50.16,10.16 52.07,8.26 | C6.1 92.84,37.34 LCD.4 92.08,40.64 89.85,42.86 81.28,42.86 80.64,42.23 80.64,36.2 83.19,33.66 83.19,16.51 81.28,14.61 50.8,14.61 50.16,13.97 50.16,10.16
N$41
  Bottom 0.305: 97.79,61.59 R23.1 ARD82-89.8
N$42
  Bottom 0.305: R16.2 172.72,60.33 172.68,60.37 172.68,62.27 172.09,62.87 X5.1
N$43
  Bottom 0.305: X5.2 164.5,68.54 163.83,69.22 83.19,69.22 82.55,68.58 R17.2 82.55,64.77
N$44
  Bottom 0.305: R18.2 159.38,61.59 159.34,61.63 X6.1
N$45
  Bottom 0.305: R19.2 87.63,67.31 88.27,67.94 153.67,67.94 154.31,67.31 154.31,62.87 X6.2
N$46
  Bottom 0.305: R20.2 139.7,60.33 139.66,60.37 139.66,62.27 139.06,62.87 X7.1
N$47
  Bottom 0.305: R21.2 92.71,66.04 93.34,66.67 130.18,66.67 130.81,66.04 130.81,62.87 X7.2
N$48
  Bottom 0.305: R22.2 125.73,62.23 125.69,61.63 X8.1
N$49
  Bottom 0.305: R23.2 97.79,64.77 98.42,65.41 120.02,65.41 120.65,64.77 120.65,62.87 X8.2
N$50
  Bottom 0.305: KBD.1 ARD90-97.8 74.93,56.2 75.88,55.24 75.88,47.94 76.52,47.31 92.08,47.31 98.74,40.64 ARD7-4.1
N$51
  Bottom 2.54: 129.54,20.32 129.54,20.02 K2.P2 K2.P1 137.16,20.32 139.7,20.32 141.92,18.1 141.92,9.53 138.75,6.35 139.06,6.35 139.04,6.33 X2.3
N$52
  Bottom 2.54: 147.32,20.32 147.32,20.02 K3.P2 K3.P1 154.94,20.32 157.16,20.32 159.7,17.78 159.7,9.53 156.53,6.35 156.21,6.99 156.19,6.33 X3.3
N$53
  Bottom 0.305: ARD7-6.2 78.11,10.16 | 78.11,10.16 81.92,10.16 85.09,6.99 SV1.1 | 78.11,10.16 R28.1
N$54
  Bottom 0.305: ARD82-89.7 95.25,65.41 95.89,66.04 127.64,66.04 128.27,65.41 128.27,58.42
  Bottom 0.406: R26.E 124.46,52.7 124.46,54.29 | 124.46,54.29 125.73,54.29 126.36,54.93 126.36,55.88 | R26.S 123.57,54.36 124.46,54.29 | 128.27,58.42 127.64,57.78 126.36,57.78 | R22.1 123.83,57.78 126.36,57.78 | 126.36,57.78 126.36,55.88 | 126.36,55.88 R27.1
N$55
  Bottom 0.305: KBD.2 ARD90-97.7 72.39,56.52 74.93,53.98 74.93,46.99 75.56,46.35 91.44,46.35 99.06,38.73 100.97,38.73 102.23,40.01 ARD7-4.2
N$56
  Bottom 0.305: ARD90-97.6 KBD.3
N$57
  Bottom 0.305: ARD90-97.5 KBD.4
N$58
  Bottom 0.305: ARD90-97.4 KBD.5
N$59
  Bottom 0.305: ARD90-97.3 KBD.6
N$60
  Bottom 0.305: ARD90-97.2 KBD.7
N$61
  Bottom 0.305: ARD90-97.1 KBD.8
N$62
  Bottom 2.54: X1.3 120.63,6.33 123.83,9.53 123.83,23.5 122.56,24.77 119.38,24.77 | 119.38,24.77 K1.O1 | K1.O2 119.15,24.99 119.38,24.77
N$63
  Bottom 0.305: R9.1 159.38,33.02 158.75,32.38 105.09,32.38 104.46,33.02 104.46,38.1 105.09,38.73 105.09,44.77 104.14,45.72 SV2.3
N$64
  Bottom 0.305: R6.1 141.6,33.66 140.97,33.02 106.05,33.02 105.41,33.66 105.41,37.47 106.05,38.1 106.05,47.62 105.41,48.26 SV2.5
N$65
  Bottom 0.305: R3.1 123.83,33.97 122.87,33.66 107,33.66 106.36,34.29 106.36,36.83 107,37.47 107,49.85 106.05,50.8 SV2.7
N$66
  Bottom 0.305: KBD.9 54.61,67.94 55.24,68.58 76.2,68.58 76.83,67.94 76.83,48.9 77.47,48.26 92.71,48.26 97.79,43.18 SV2.2
N$67
  Bottom 1.016: C1.1 15.88,52.7 12.7,52.7
  Bottom 1.27: C2.+ 8.89,48.26 10.16,49.53 12.7,49.53 | L1.1 13.97,49.53 12.7,49.53 | 12.7,49.53 12.7,52.7 D5.C
N$68
  Bottom 1.27: 21.59,22.23 C8.+ | 21.59,22.23 21.59,18.41 20.32,17.14 5.71,17.14 4.45,18.41 4.45,40.01 5.71,41.27 12.06,41.27 13.97,42.55 L1.2 | 21.59,22.23 21.59,26.04 | 21.59,26.04 IC1.3 | 21.59,26.04 C7.1
N$69
  Bottom 2.54: K2.O1 137.16,25.08 137.07,24.99 K2.O2
N$70
  Bottom 2.54: 155.03,24.99 K3.O1 | K3.O2 155.03,24.99 | 155.03,24.99 155.26,24.77
N$71
  Bottom 2.54: 172.95,24.99 K4.O1 | K4.O2 172.95,24.99 | 172.95,24.99 173.04,25.08
N$72
  Bottom 0.61: ARD7-3.2 89.53,15.24 87.63,15.24 87,14.61 87,10.79 90.17,7.62 SV1.3
N$74
  Bottom 0.61: 155.89,53.98 arc270 155.26,54.61
N$75
  Bottom 0.61: 122.87,53.98 arc270 122.24,54.61
N$76
  Bottom 0.61: 121.6,52.39 arc-270 120.97,53.02
N$77
  Bottom 0.61: 139.38,53.98 arc270 138.75,54.61
N$78
  Bottom 0.61: 138.11,52.39 arc-270 137.48,53.02
N$79
  Bottom 0.61: 153.99,53.02 arc270 154.62,52.39
SCL
  Bottom 0.305: 44.45,1.27 25.4,1.27 24.77,1.91 ARD43-44.1 | 44.45,1.27 64.77,1.27 | 64.77,1.27 I2C.1 | 44.45,1.27 RTC.1 | 64.77,1.27 92.71,1.27 93.34,1.91 93.34,9.53 I2C2.1 94.3,11.75 94.3,14.29 88.27,20.32 88.27,39.37 87.63,40.01 85.09,40.01 84.45,39.37 LCD.1
SDA
  Bottom 0.305: ARD43-44.2 27.3,2.54 27.94,1.91 41.91,1.91 42.55,2.54 42.55,6.35 43.18,6.99 46.35,6.99 46.99,6.35 RTC.2 46.99,2.54 47.62,1.91 62.23,1.91 62.87,2.54 62.87,5.71 63.5,6.35 66.67,6.35 67.31,5.71 I2C.2 67.31,2.54 67.94,1.91 91.44,1.91 92.08,2.54 92.08,8.26 I2C2.2 90.17,10.48 91.44,11.75 92.39,11.75 93.34,12.7 93.34,13.97 87,20.32 LCD.2
(copper drawn outside any net)
  shapes: Bottom circle x7

### Text on the board
Bottom: JDC (c)2015 | Zavlazovac v15